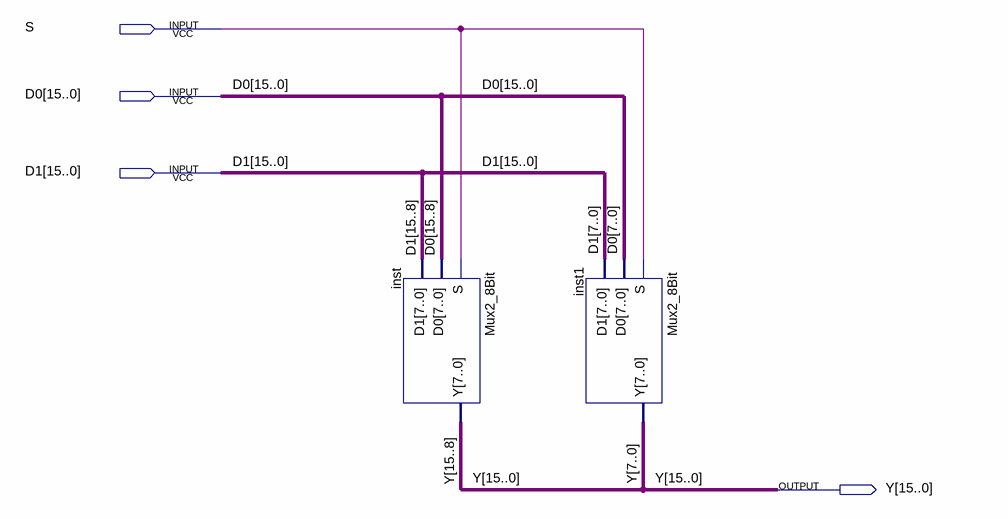
[diagram p0: schematic sheet]
// Quartus schematic Mux2_16Bit.bdf as structural Verilog: 2 symbols, 4 pins
module Mux2_16Bit (
  input  S,
  input  [15:0] D0,
  input  [15:0] D1,
  output [15:0] Y
);

  Mux2_8Bit inst (.S(S), .D0(D0[15:8]), .D1(D1[15:8]), .Y(Y[15:8]));
  Mux2_8Bit inst1 (.S(S), .D0(D0[7:0]), .D1(D1[7:0]), .Y(Y[7:0]));
endmodule
